# Altium schematic sheet ADC_CH.SchDoc
size A4
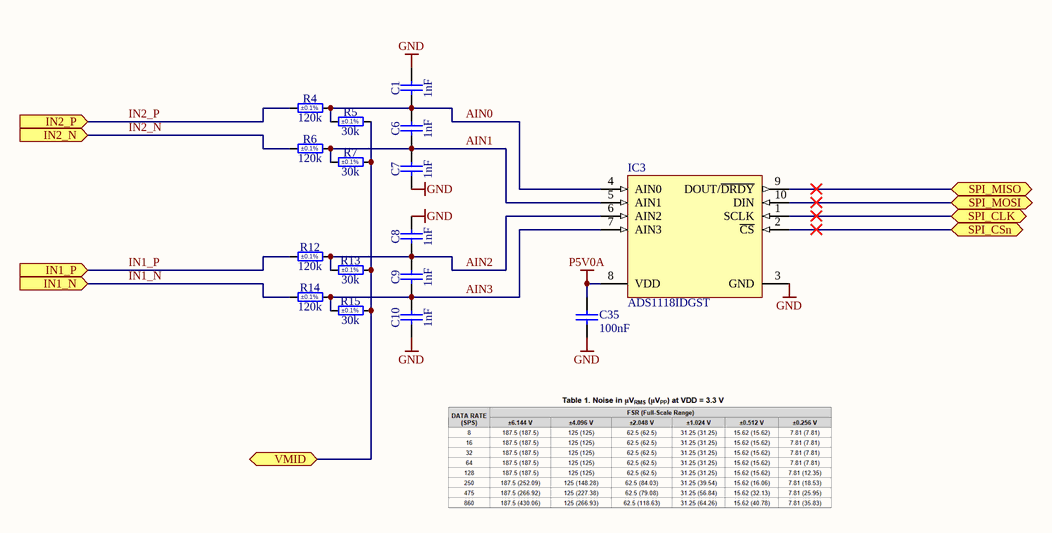
[diagram p0: ADC_CH.SchDoc]

## Parts
C1  1nF  [CAPC1608X90N]
C6  1nF  [CAPC1608X90N]
C7  1nF  [CAPC1608X90N]
C8  1nF  [CAPC1608X90N]
C9  1nF  [CAPC1608X90N]
C10  1nF  [CAPC1608X90N]
C35  100nF  [CAPC1005X55N]
IC3  ADS1118IDGST  [SOP50P490X110-10N]
R4  120k  Tolerance: ±0.1%  [RESC3216X65N]
R5  30k  Tolerance: ±0.1%  [RESC1608X55N]
R6  120k  Tolerance: ±0.1%  [RESC3216X65N]
R7  30k  Tolerance: ±0.1%  [RESC1608X55N]
R12  120k  Tolerance: ±0.1%  [RESC3216X65N]
R13  30k  Tolerance: ±0.1%  [RESC1608X55N]
R14  120k  Tolerance: ±0.1%  [RESC3216X65N]
R15  30k  Tolerance: ±0.1%  [RESC1608X55N]

## Ports
IN1_N (in), IN1_P (in), IN2_N (in), IN2_P (in), SPI_CLK (bidir), SPI_CSn (bidir), SPI_MISO (bidir), SPI_MOSI (bidir), VMID (bidir)

## Nets
GND: C1.2 C7.1 C8.2 C10.1 C35.1 IC3.3(GND)
P5V0A: C35.2 IC3.8(VDD)
AIN0: C1.1 C6.2 IC3.4(AIN0) R4.2 R5.1
AIN1: C6.1 C7.2 IC3.5(AIN1) R6.2 R7.1
AIN2: C8.1 C9.2 IC3.6(AIN2) R12.2 R13.1
AIN3: C9.1 C10.2 IC3.7(AIN3) R14.2 R15.1
IN1_N: R14.1 ; port IN1_N
IN1_P: R12.1 ; port IN1_P
IN2_N: R6.1 ; port IN2_N
IN2_P: R4.1 ; port IN2_P
SPI_CLK: IC3.1(SCLK) ; port SPI_CLK
SPI_CSn: IC3.2(~{CS}) ; port SPI_CSn
SPI_MISO: IC3.9(DOUT/~{DRDY}) ; port SPI_MISO
SPI_MOSI: IC3.10(DIN) ; port SPI_MOSI
VMID: R5.2 R7.2 R13.2 R15.2 ; port VMID

## Library data of the parts
C1 C6-C10 = CC0603_1NF_50V_5%_NP0: Non-polarised capacitor; Part Description: SMD Multilayer Chip Ceramic Capacitor; Manufacturer: GENERIC; Manufacturer1 Part Number: CC0603JRNPO9BN102; Voltage: 50V; TC: C0G/NP0; Tolerance: ±5%; Part Number: CC0603_1NF_50V_5%_NP0; Component Kind: Standard; Component Type: Standard; Pin Count: 2; Value: 1nF; Status: Preferred; Manufacturer Part Number: CC0603_1NF_50V_5%_NP0; Case: 0603; Mounted: Yes; Socket: No; SMD: Yes; Sense: No; Manufacturer1 Example: YAGEO PHYCOMP; Manufacturer1 ComponentHeight: 0.9mm; HelpURL: \\cern.ch\dfs\Applications\Altium\Datasheets\CC0805_NP0_PHYCOMP_16VTO50V.pdf; Author: CERN DEM JLC; CreateDate: 22.10.2012; LatestRevisionDate: 22.10.2012
C35 = CC0402_100NF_16V_10%_X7R: Non-polarised capacitor; Part Description: SMD Multilayer Chip Ceramic Capacitor; Manufacturer: GENERIC; Manufacturer1 Part Number: GRM155R71C104KA88D; Voltage: 16V; TC: X7R; Tolerance: ±10%; Part Number: CC0402_100NF_16V_10%_X7R; Component Kind: Standard; Component Type: Standard; Pin Count: 2; Value: 100nF; Status: Not Recommended; Manufacturer Part Number: CC0402_100NF_16V_10%_X7R; Case: 0402; Mounted: Yes; Socket: No; SMD: Yes; Sense: No; Manufacturer1 Example: MURATA; Manufacturer1 ComponentHeight: 0.55mm; HelpURL: \\cern.ch\dfs\Applications\Altium\Datasheets\CC0402_X7R_MURATA_GRM.pdf; Author: CERN DEM JLC; CreateDate: 12/5/2013; LatestRevisionDate: 12/3/2007
IC3 = ADS1118IDGST: Quad Channel Single ADC Delta-Sigma 860sps 16-bit Serial 10-Pin VSSOP T/R; Manufacturer: Texas Instruments; Min Supply Voltage: 2V; Max Supply Voltage: 5.5V; Number of Channels: 2; Max Power Dissipation: 900uW; Operating Supply Voltage: 3.3V; Interface: SPI; Number of Bits: 16; Number of Converters: 1; Resolution: 16b; Sampling Rate: 860S/s; Polarity: Bipolar; Integral Nonlinearity (INL): 1LSB; Number of Inputs: 4; Supply Current: 150uA; Supplier: Mouser; Supplier Part Number: 595-ADS1118IDGST; Manufacturer Part Number: ADS1118IDGST; RoHS: Yes; Category: Analog to Digital Converters (ADCs); Stock: 2422; Pricing: 1=6.29, 10=4.83, 25=4.47, 50=4.47, 100=4.07, 250=3.87, 500=3.69, 1000=3.59, 2500=3.5, 10000=3.59 (USD); Case/Package: VSSOP; Pins: 10; Contact Plating: Gold; Min Operating Temperature: -40°C; Max Operating Temperature: 125°C; Package Quantity: 250; Packaging: Tape and Reel; Number of A/D Converters: 1; Number of Elements: 1; Supply Type: Single; Conversion Rate: 860S/s; Max Supply Voltage (DC): 5.5V; Min Supply Voltage (DC): 2V; Power Dissipation: 900uW; Series: -; Length: 3.1mm; Width: 3.1mm; Height: 1.1mm; Thickness: 1.02mm; Reach SVHC Compliant: No; Lead Free: Lead Free; RoHS Compliant: Yes; ComponentLink1URL: https://datasheet.ciiva.com/7989/1634024-7989312.pdf?src-supplier=Element14; ComponentLink1Description: https://datasheet.ciiva.com/7989/1634024-7989312.pdf?src-supplier=Element14; ComponentLink2URL: https://datasheet.ciiva.com/41461/001186694-da-01-en-ic-adc-16bit-sp-ads1118idgst-msop-10-tid-41461012.pdf?src-supplier=Conrad; ComponentLink2Description: https://datasheet.ciiva.com/41461/001186694-da-01-en-ic-adc-16bit-sp-ads1118idgst-msop-10-tid-41461012.pdf?src-supplier=Conrad; ComponentLink3URL: https://datasheet.ciiva.com/1261/ads1118-1261457.pdf?src-supplier=Digikey; ComponentLink3Description: https://datasheet.ciiva.com/1261/ads1118-1261457.pdf?src-supplier=Digikey; ComponentLink4URL: https://datasheet.ciiva.com/1261/ads1118-1261458.pdf?src-supplier=Digikey; ComponentLink4Description: https://datasheet.ciiva.com/1261/ads1118-1261458.pdf?src-supplier=Digikey; ComponentLink5URL: https://datasheet.ciiva.com/1261/ads1118-1261459.pdf?src-supplier=Digikey; ComponentLink5Description: https://datasheet.ciiva.com/1261/ads1118-1261459.pdf?src-supplier=Digikey; ComponentLink6URL: https://datasheet.ciiva.com/14259/ads1118-14259989.pdf?src-supplier=Avnet; ComponentLink6Description: https://datasheet.ciiva.com/14259/ads1118-14259989.pdf?src-supplier=Avnet; ComponentLink7URL: https://datasheet.ciiva.com/46394/1793017-46394506.pdf?src-supplier=Element14; ComponentLink7Description: https://datasheet.ciiva.com/46394/1793017-46394506.pdf?src-supplier=Element14; ComponentLink8URL: https://datasheet.ciiva.com/46394/1793017-46394507.pdf?src-supplier=Element14; ComponentLink8Description: https://datasheet.ciiva.com/46394/1793017-46394507.pdf?src-supplier=Element14
R4 R6 R12 R14 = R1206_120K_0.1%_0.25W_25PPM: Resistor - 0.1%; Part Description: Thin Film Chip Resistor; Manufacturer: GENERIC; Manufacturer1 Part Number: RN73H2BTTD1203B25; Power: 0.25W; TC: ±25ppm/°C; PressFit: No; Part Number: R1206_120K_0.1%_0.25W_25PPM; Component Kind: Standard; Component Type: Standard; Pin Count: 2; Value: 120k; Status: Not Recommended; Manufacturer Part Number: R1206_120K_0.1%_0.25W_25PPM; Case: 1206; Mounted: Yes; Sense: No; Socket: No; SMD: Yes; Manufacturer1 Example: KOA; Manufacturer1 ComponentHeight: 0.70mm; HelpURL: \\cern.ch\dfs\Applications\Altium\Datasheets\R1206_KOA_RN73H.pdf; Author: CERN DEM JLC; CreateDate: 03.12.2007; LatestRevisionDate: 13.03.2008
R5 R7 R13 R15 = R0603_30K_0.1%_0.063W_25PPM: Resistor - 0.1%; Part Description: Thin Film Precision Resistor; Manufacturer: GENERIC; Manufacturer1 Part Number: CPF0603B30KE; Power: 0.063W; TC: ±25ppm/°C; PressFit: No; Part Number: R0603_30K_0.1%_0.063W_25PPM; Component Kind: Standard; Component Type: Standard; Pin Count: 2; Value: 30k; Status: Not Recommended; Manufacturer Part Number: R0603_30K_0.1%_0.063W_25PPM; Case: 0603; Mounted: Yes; Sense: No; Socket: No; SMD: Yes; Manufacturer1 Example: TE CONNECTIVITY; Manufacturer1 ComponentHeight: 0.55mm; HelpURL: \\cern.ch\dfs\Applications\Altium\Datasheets\R0603_TYCO_CPF.pdf; Author: CERN DEM JMW; CreateDate: 28.07.2021; LatestRevisionDate: 28.07.2021